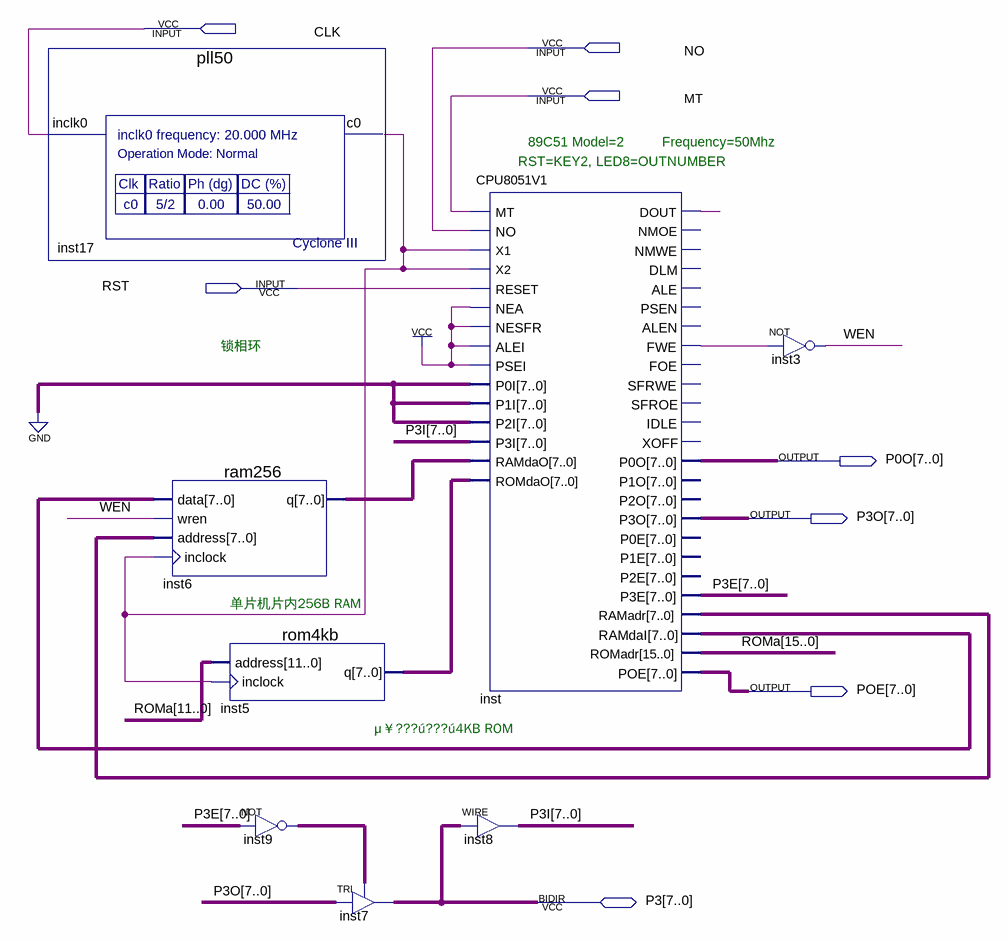
[diagram p0: schematic sheet]
// Quartus schematic MCU8951.bdf as structural Verilog: 8 symbols, 8 pins
module MCU8951 (
  input  CLK,
  input  NO,
  input  MT,
  input  RST,
  inout  [7:0] P3,
  output [7:0] P0O,
  output [7:0] P3O,
  output [7:0] POE
);

  wire inst17_c0, inst_dout, inst_fwe, WEN;
  wire [7:0] inst5_q, inst6_q, inst9_out, inst_ramadr, inst_ramdai, P3E, P3I;
  wire [15:0] ROMa;

  pll50 inst17 (.inclk0(CLK), .c0(inst17_c0));
  ram256 inst6 (.data(inst_ramdai), .wren(WEN), .address(inst_ramadr), .inclock(inst17_c0), .q(inst6_q));
  rom4kb inst5 (.address(ROMa[11:0]), .inclock(inst17_c0), .q(inst5_q));
  assign inst9_out = ~P3E;  // NOT inst9, 8 bits wide
  TRI inst7[7:0] (.IN(P3O), .OE(inst9_out), .OUT(P3));
  CPU8051V1 inst (
    .MT(MT), .NO(NO), .X1(inst17_c0), .X2(inst17_c0), .RESET(RST), .NEA(1'b1), .NESFR(1'b1), .ALEI(1'b1),
    .PSEI(1'b1), .P0I({8{1'b0}}), .P1I({8{1'b0}}), .P2I({8{1'b0}}), .P3I(P3I), .RAMdaO(inst6_q),
    .ROMdaO(inst5_q), .DOUT(inst_dout), .FWE(inst_fwe), .P0O(P0O), .P3O(P3O), .P3E(P3E),
    .RAMadr(inst_ramadr), .RAMdaI(inst_ramdai), .ROMadr(ROMa), .POE(POE));  // open: NMOE, NMWE, DLM, ALE, PSEN, ALEN, FOE, SFRWE, SFROE, IDLE, XOFF, P1O, P2O, P0E, P1E, P2E
  assign P3I = P3;  // WIRE inst8
  not inst3 (WEN, inst_fwe);

  // Notes on the sheet:
  //   89C51 Model=2  
  //   Frequency=50Mhz
  //   RST=KEY2, LED8=OUTNUMBER    
  //   锁相环
  //   单片机片内256B RAM
  //   μ￥???ú???ú4KB ROM
endmodule
